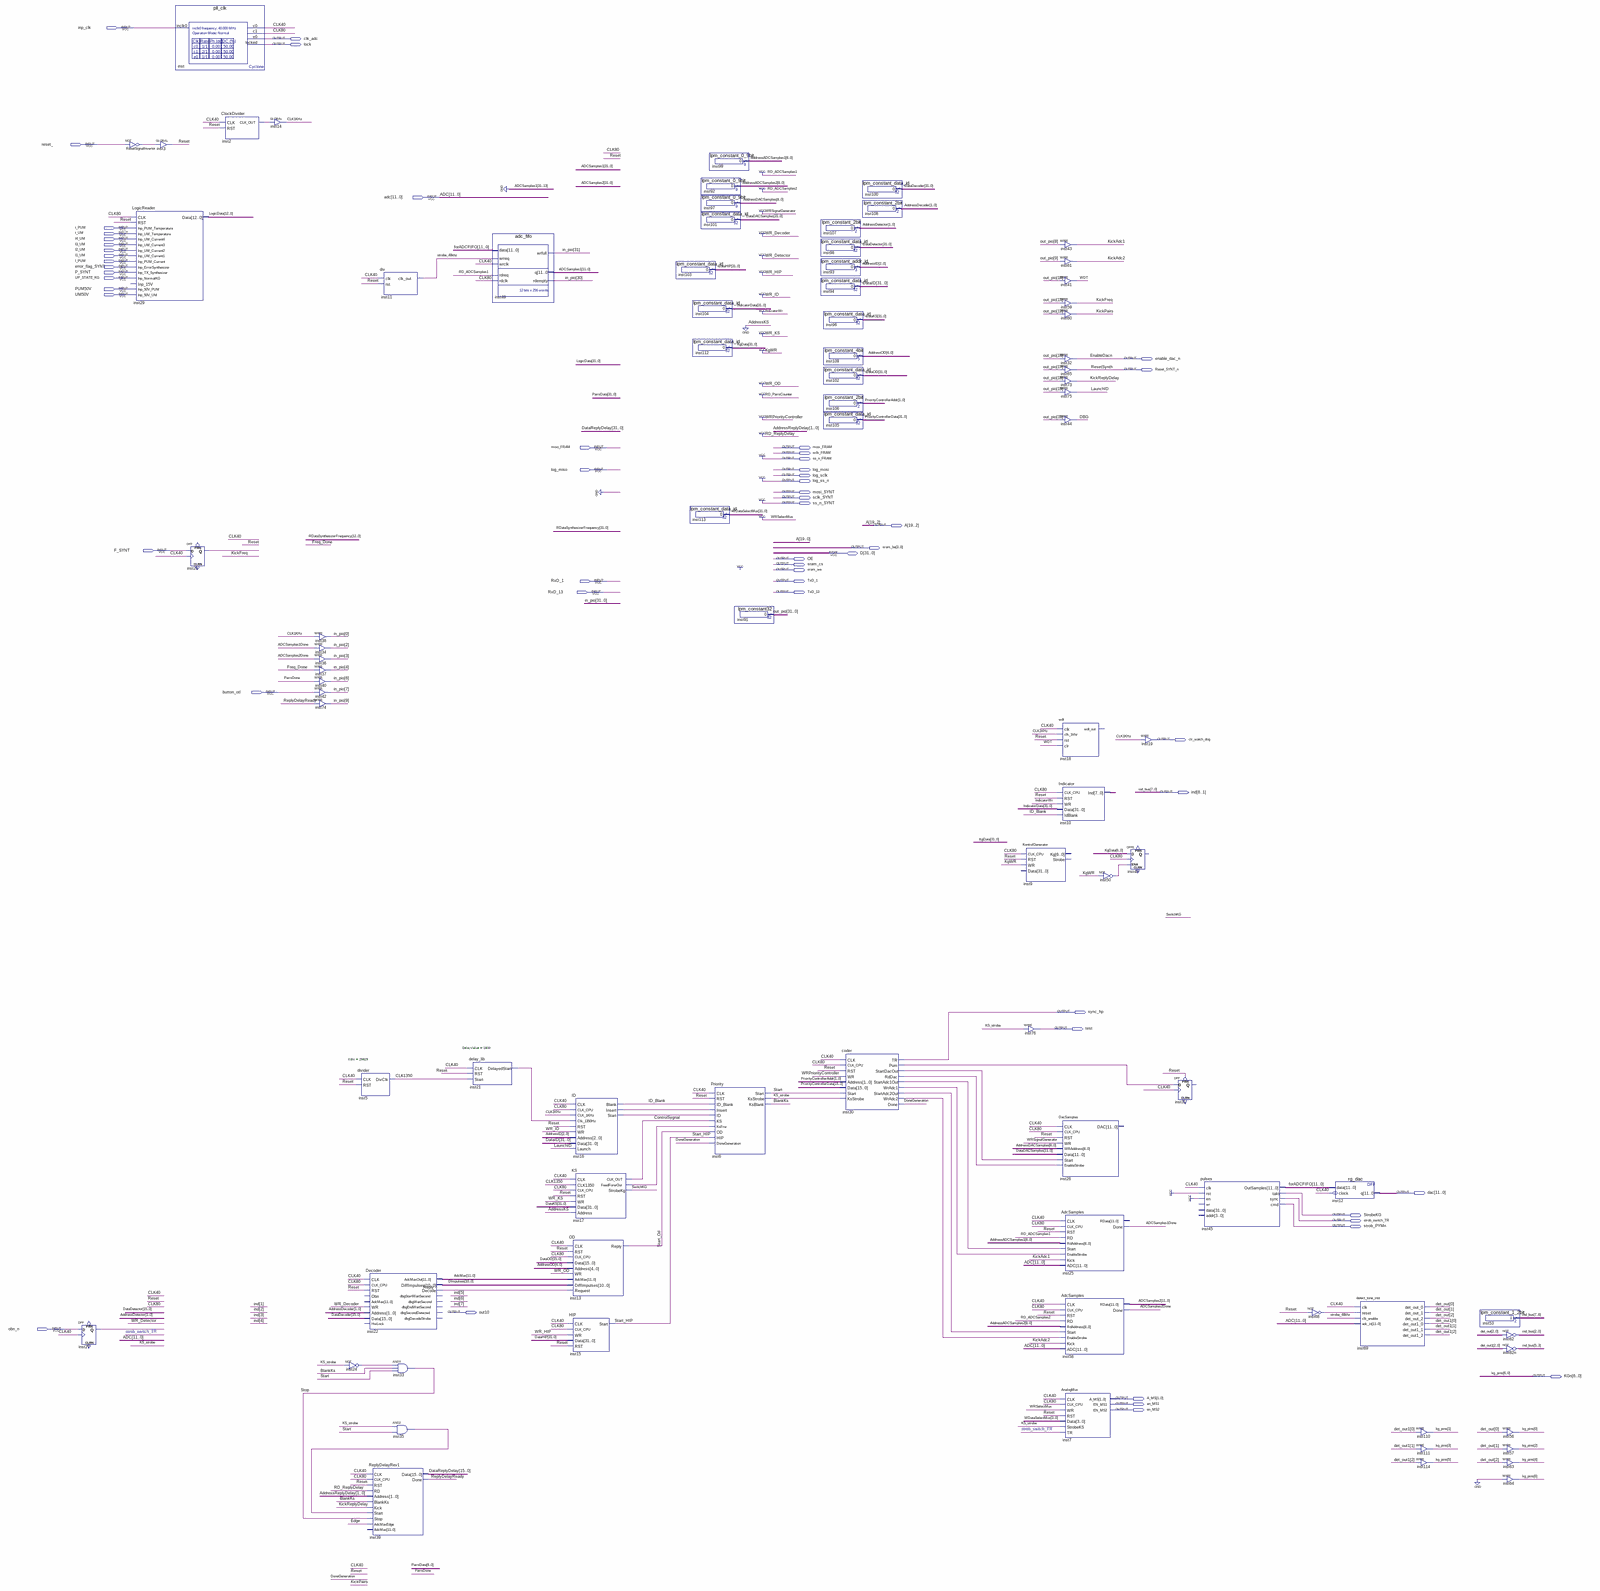
[diagram p0: schematic sheet, whole]
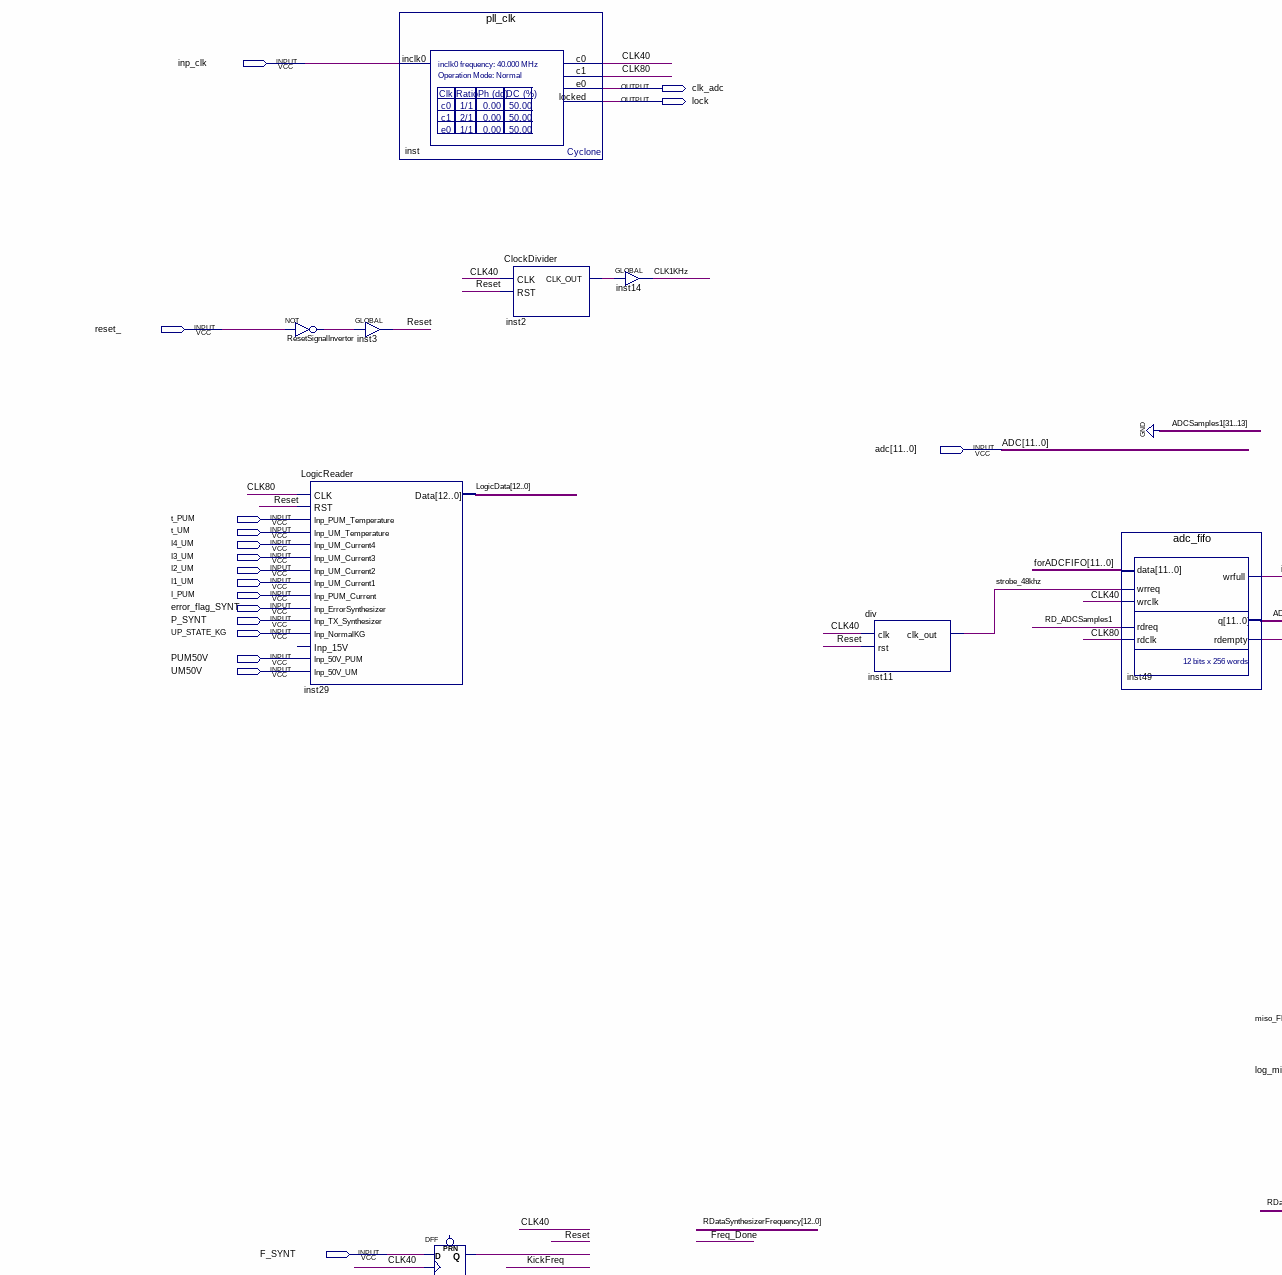
[diagram p1: schematic sheet, upper left part]
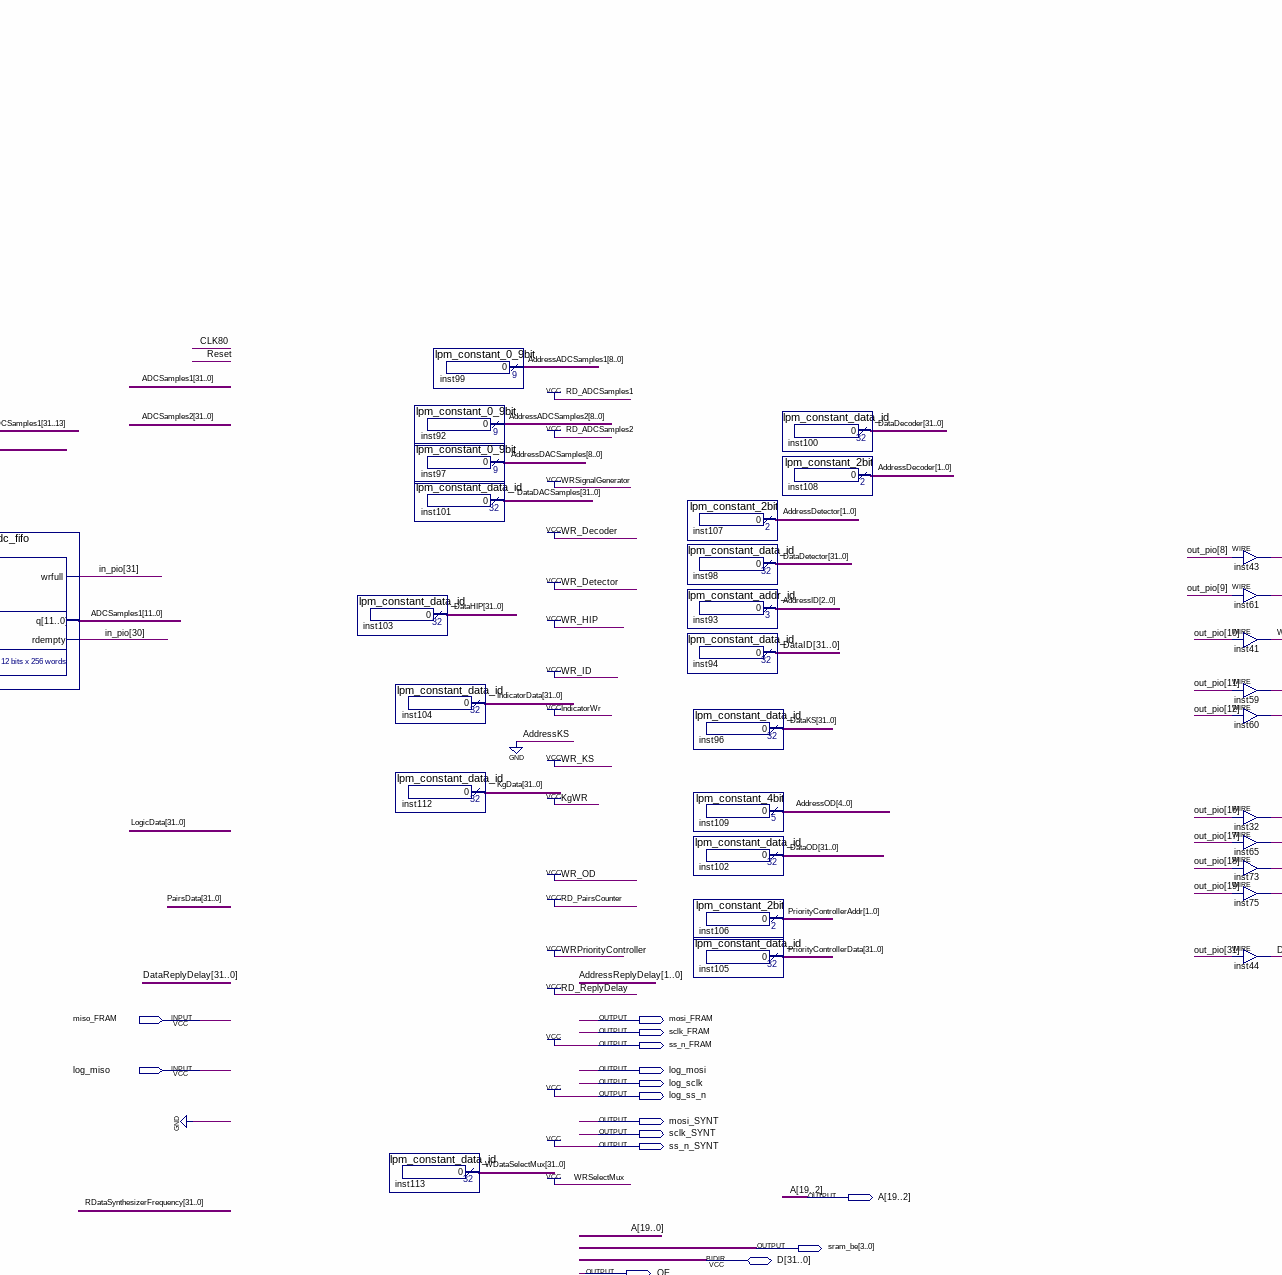
[diagram p2: schematic sheet, upper centre part]
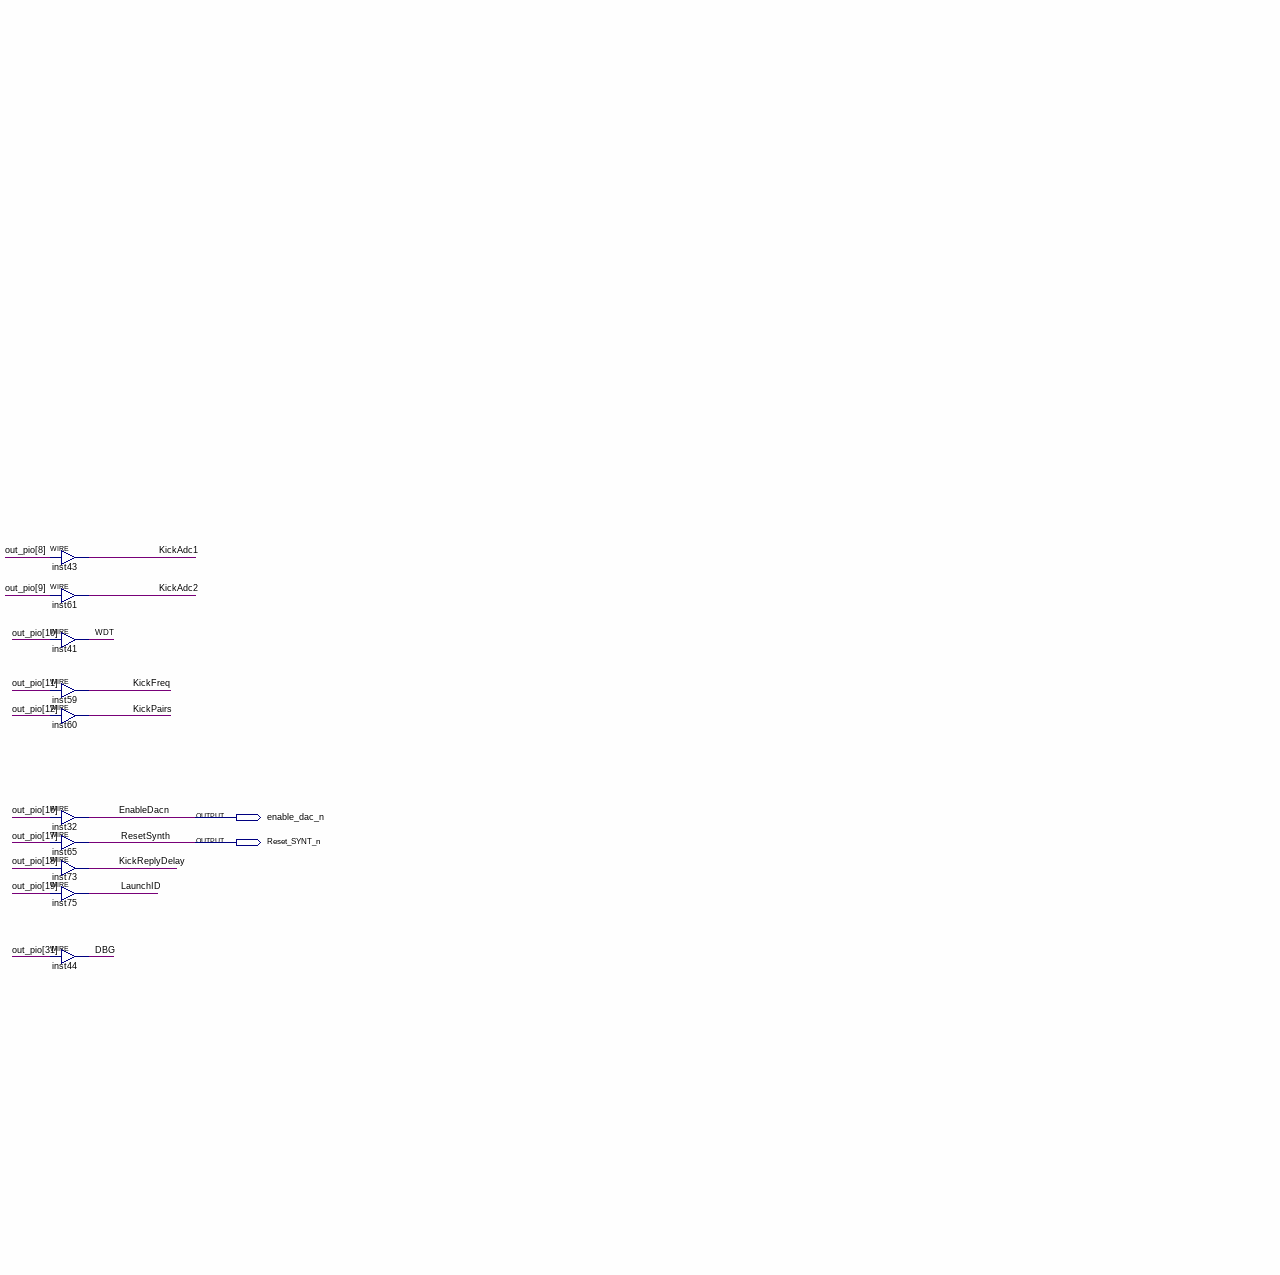
[diagram p3: schematic sheet, upper right part]
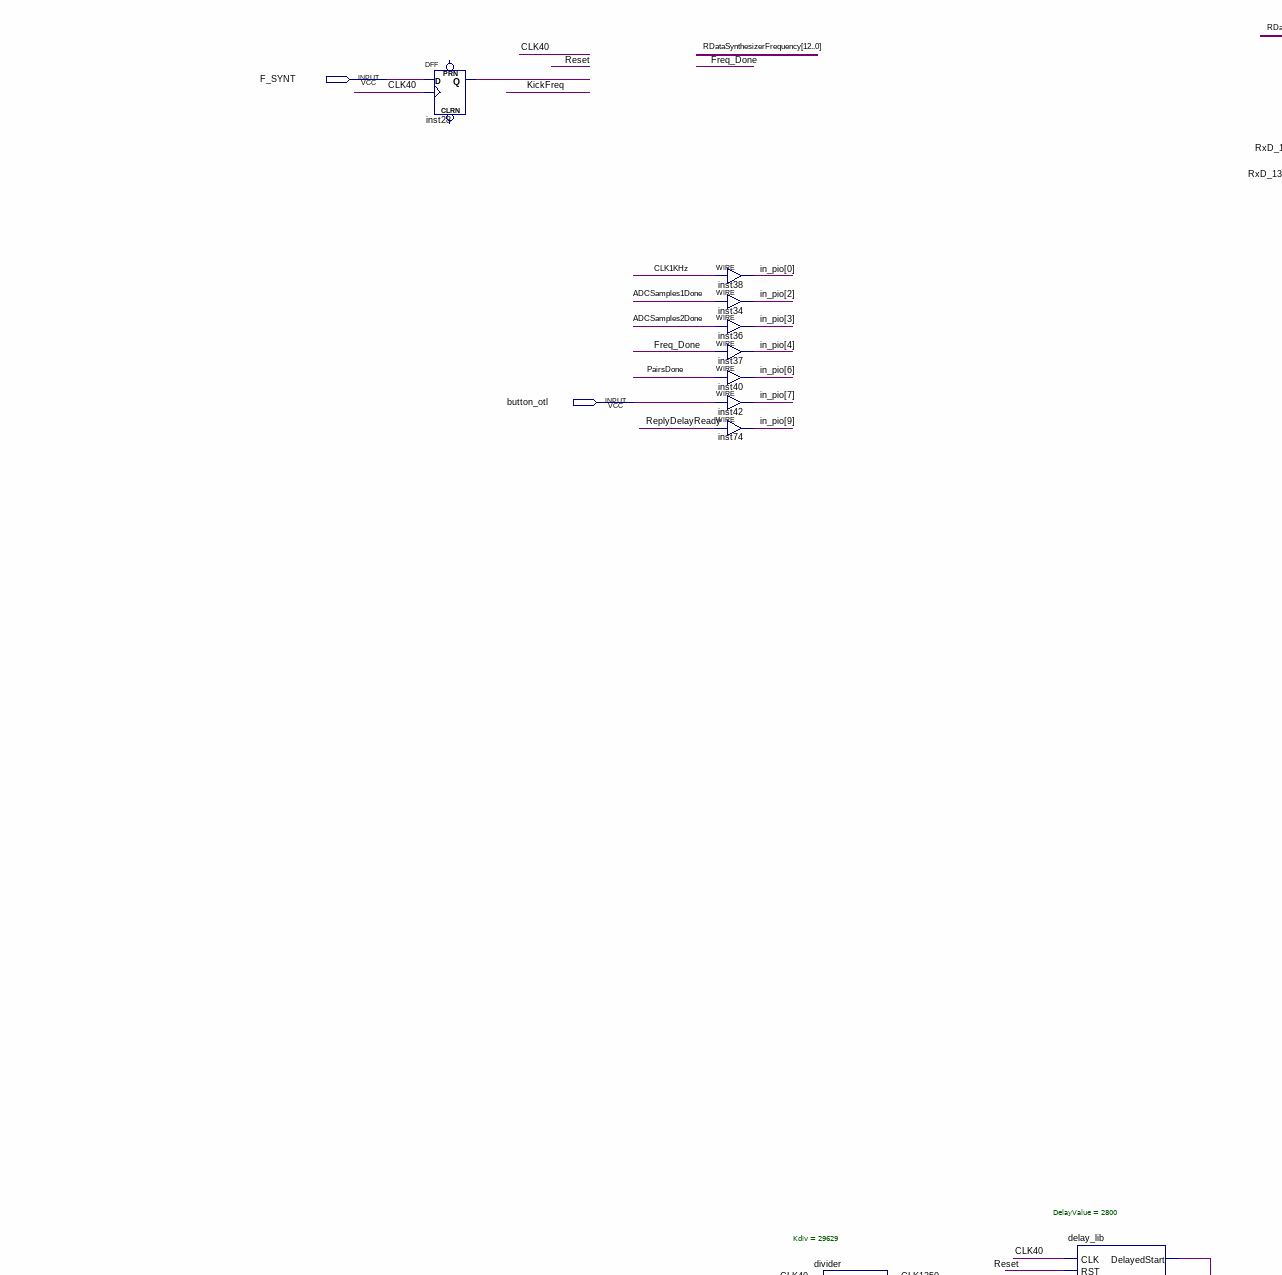
[diagram p4: schematic sheet, middle left part]
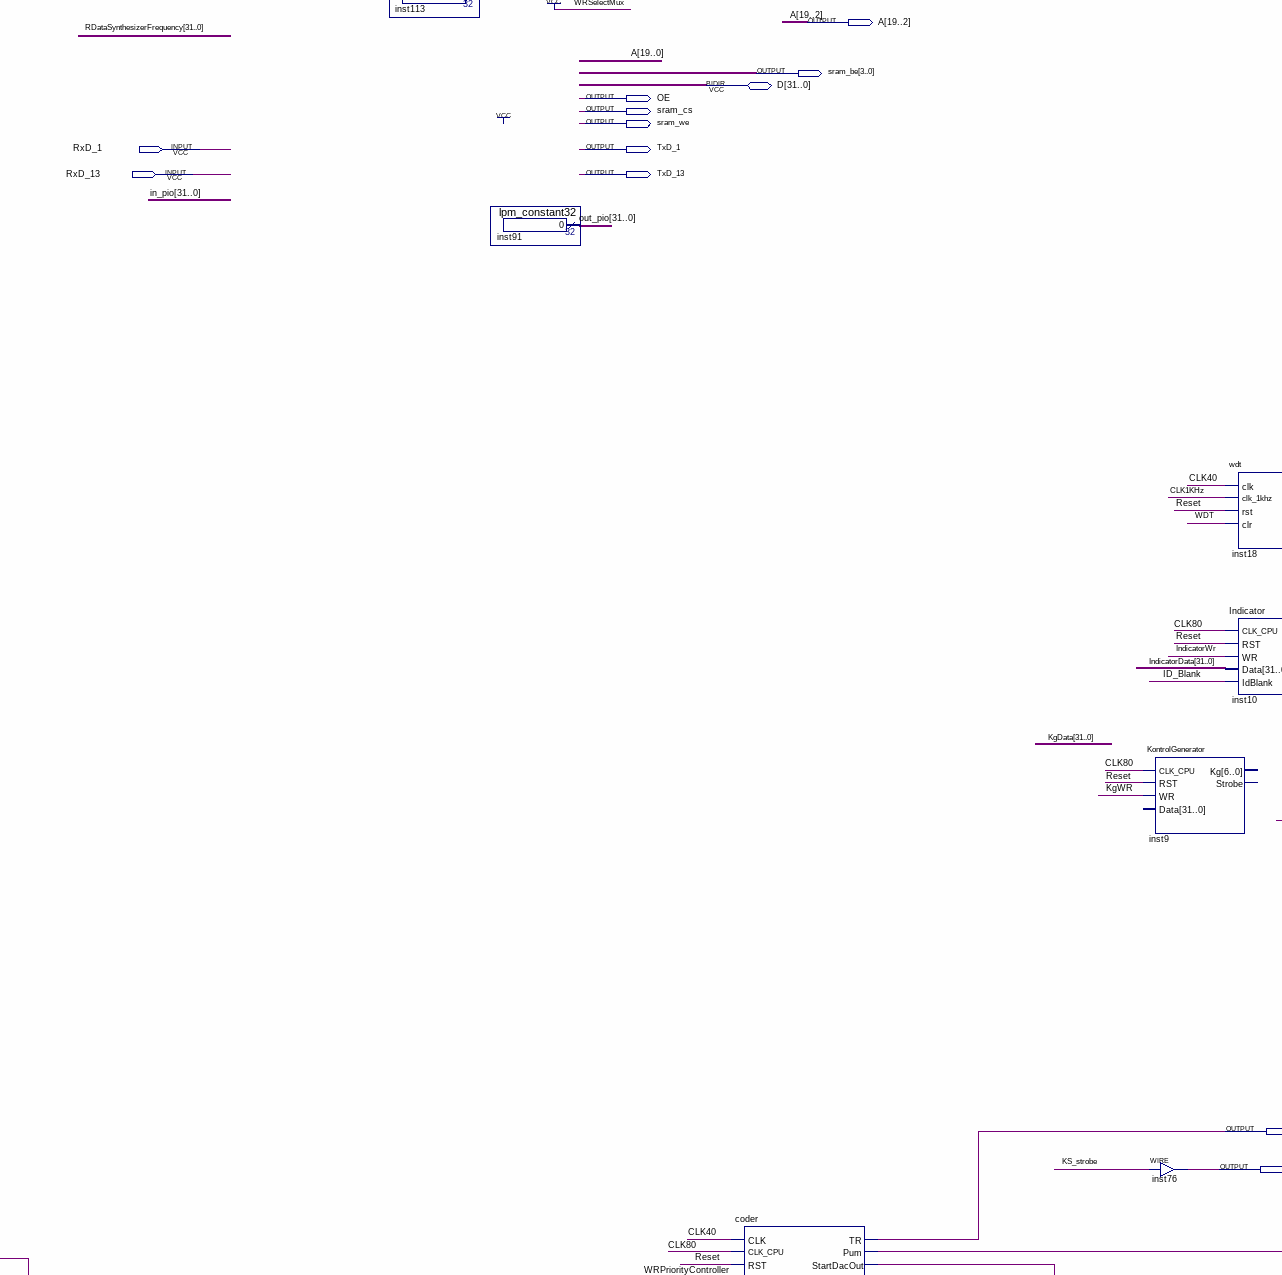
[diagram p5: schematic sheet, middle centre part]
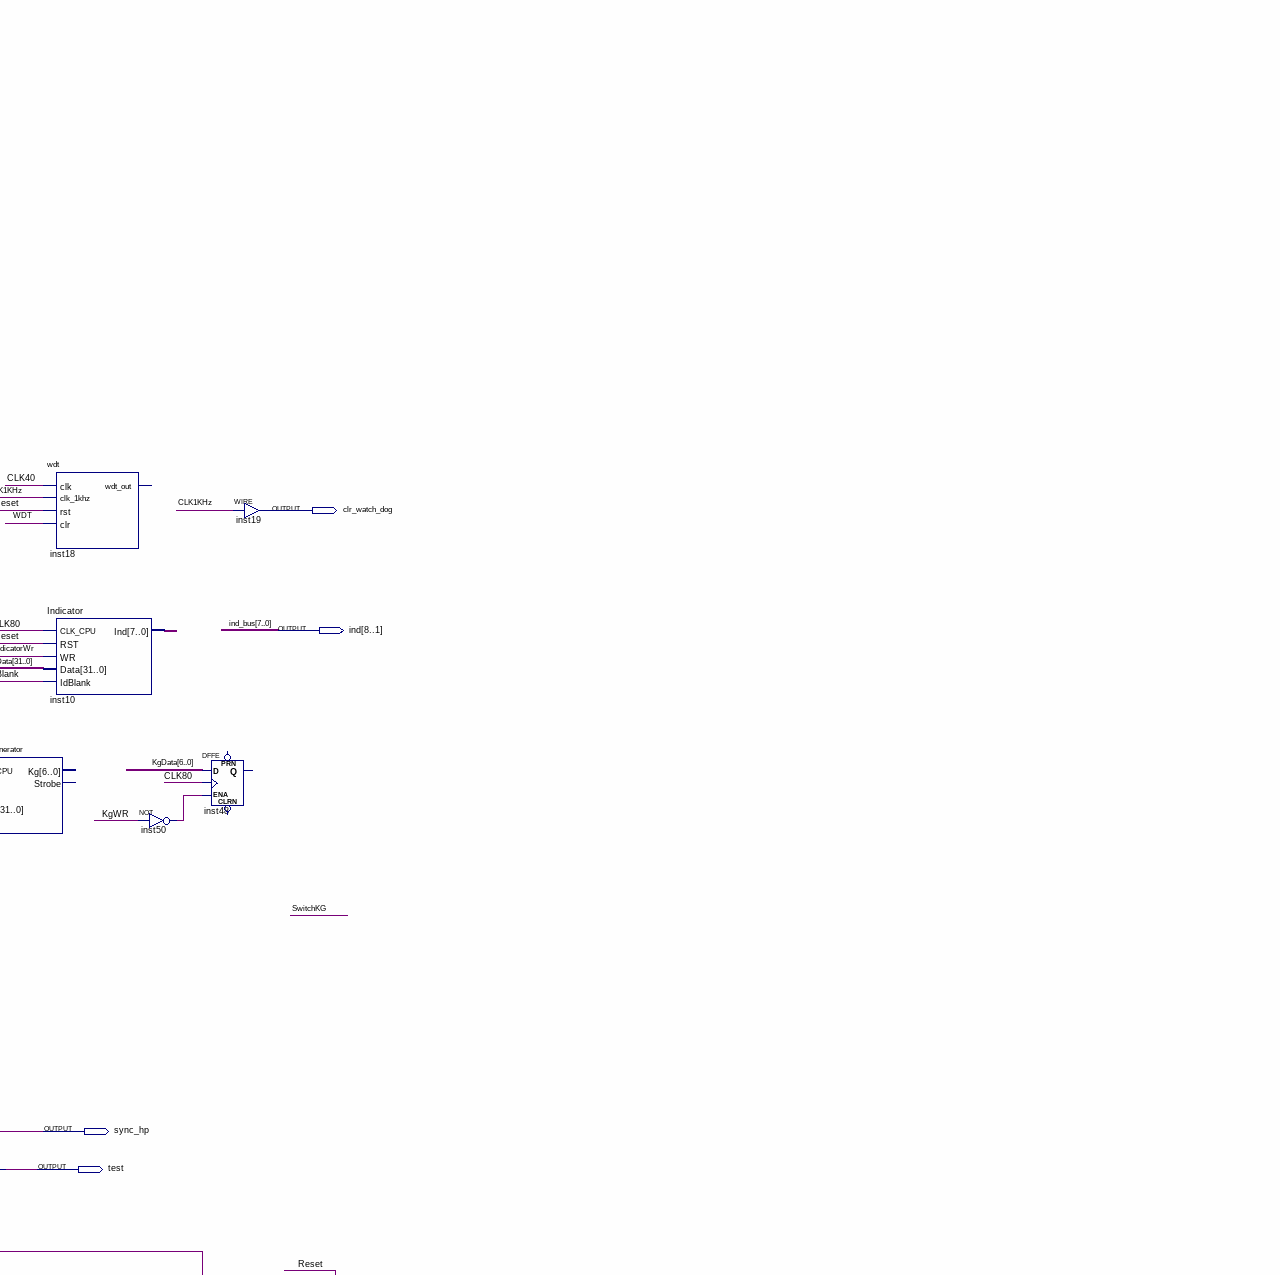
[diagram p6: schematic sheet, middle right part]
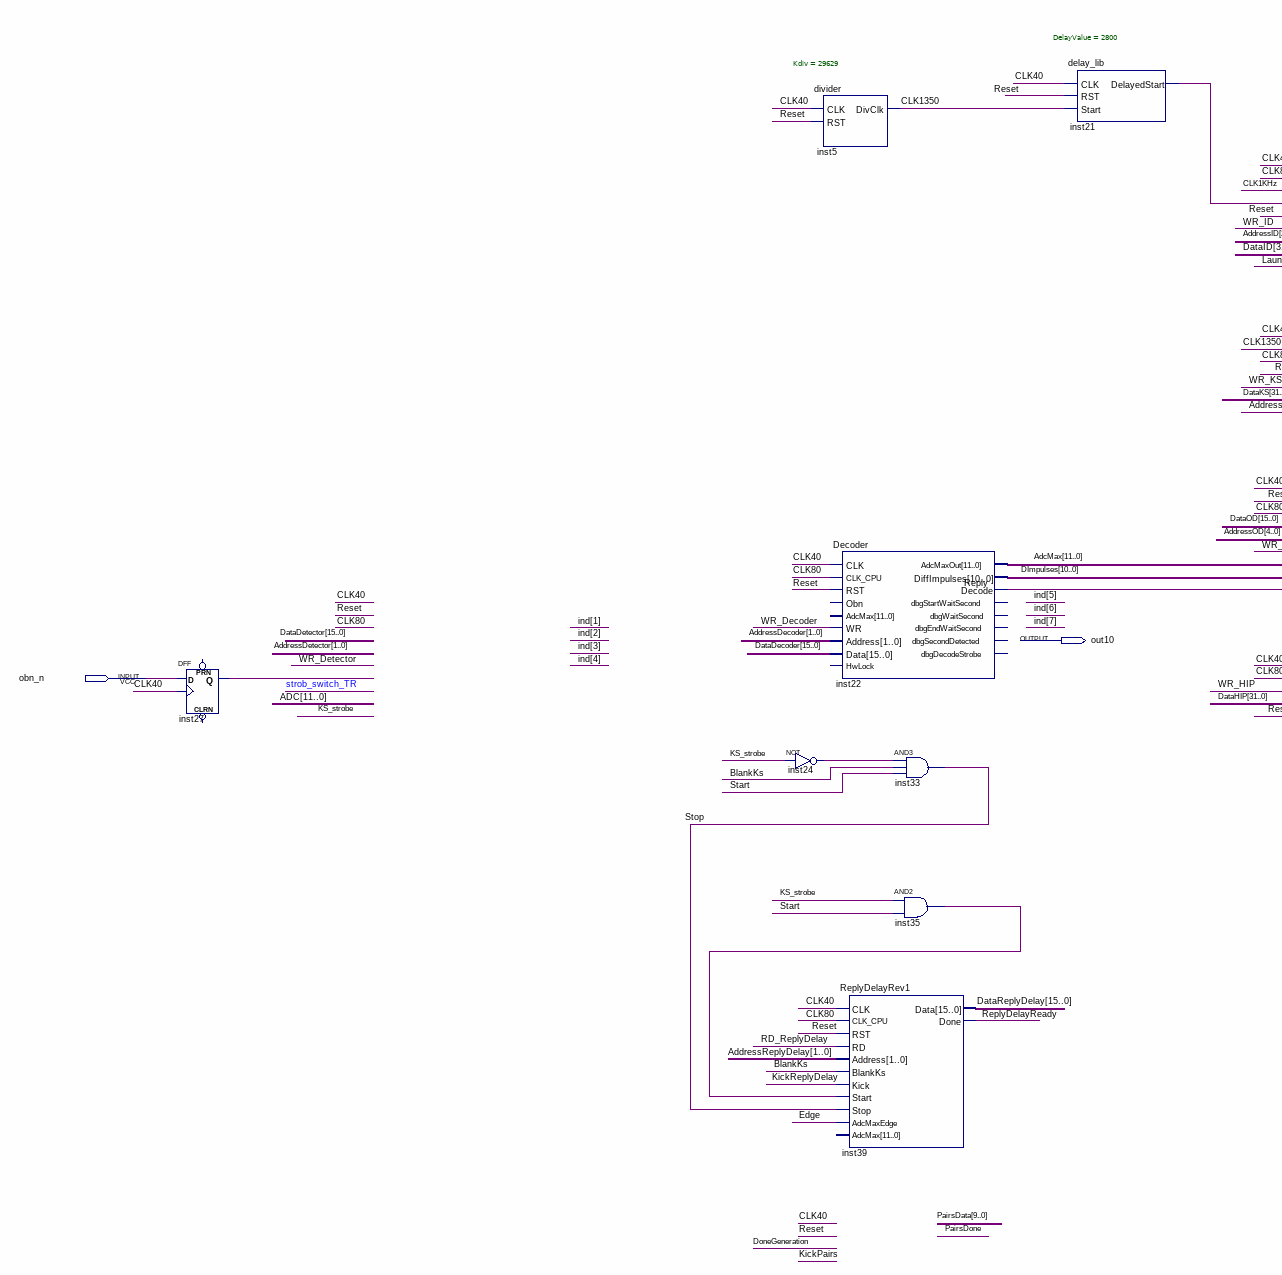
[diagram p7: schematic sheet, lower left part]
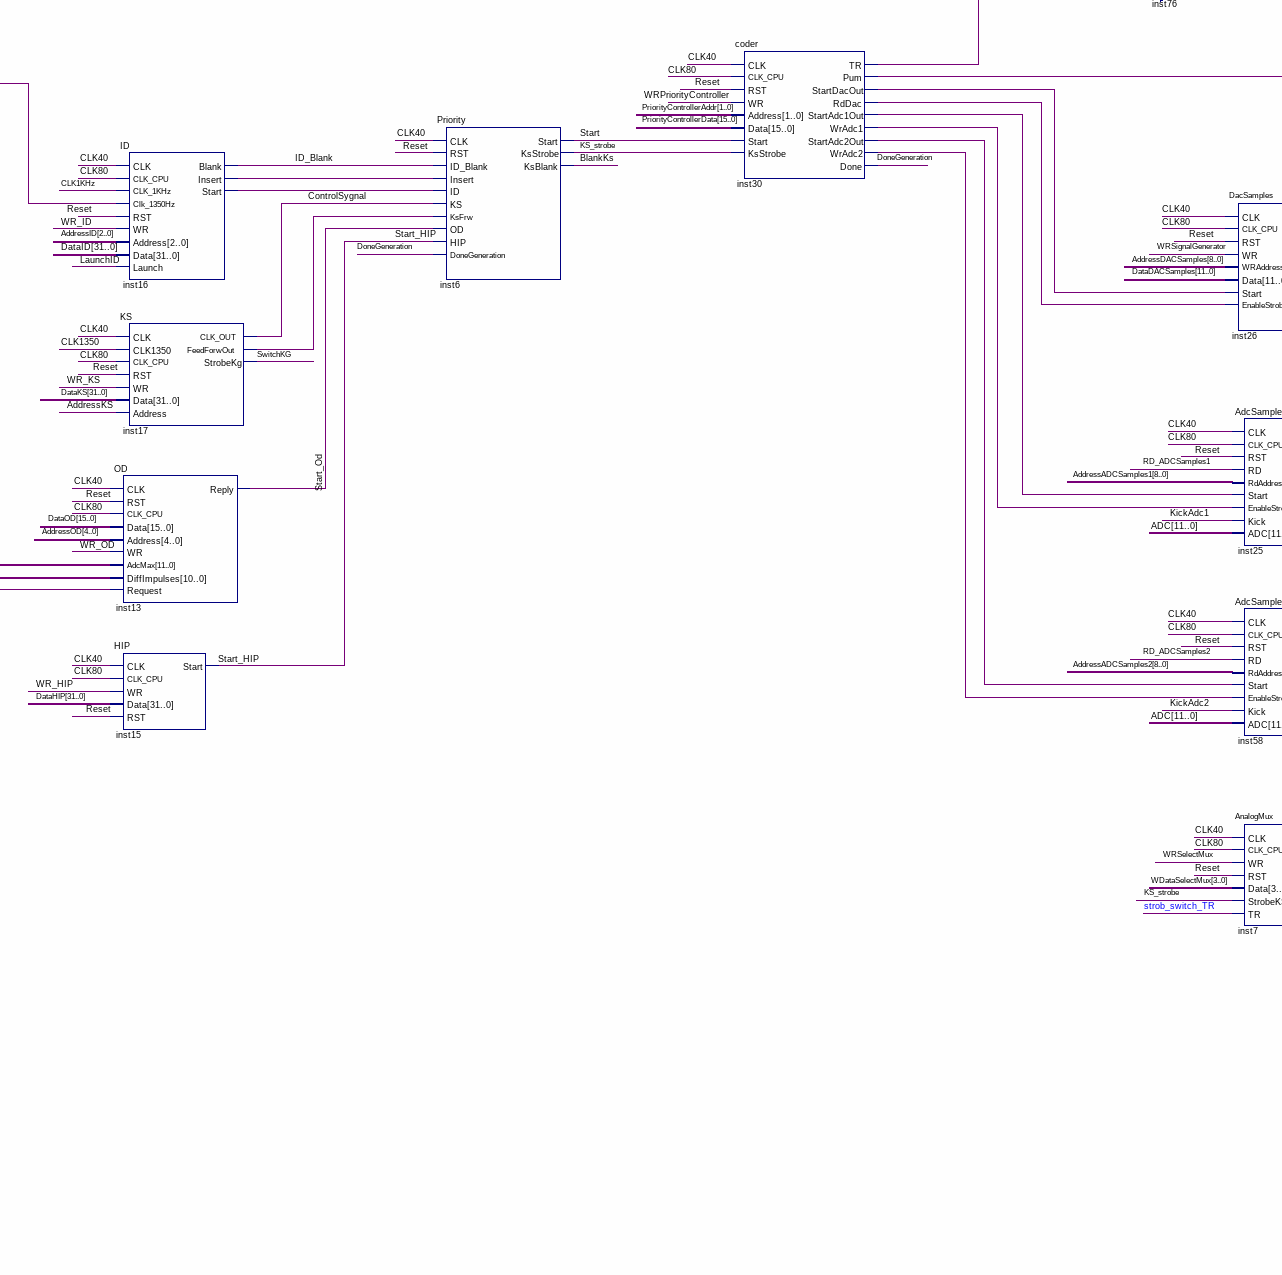
[diagram p8: schematic sheet, lower centre part]
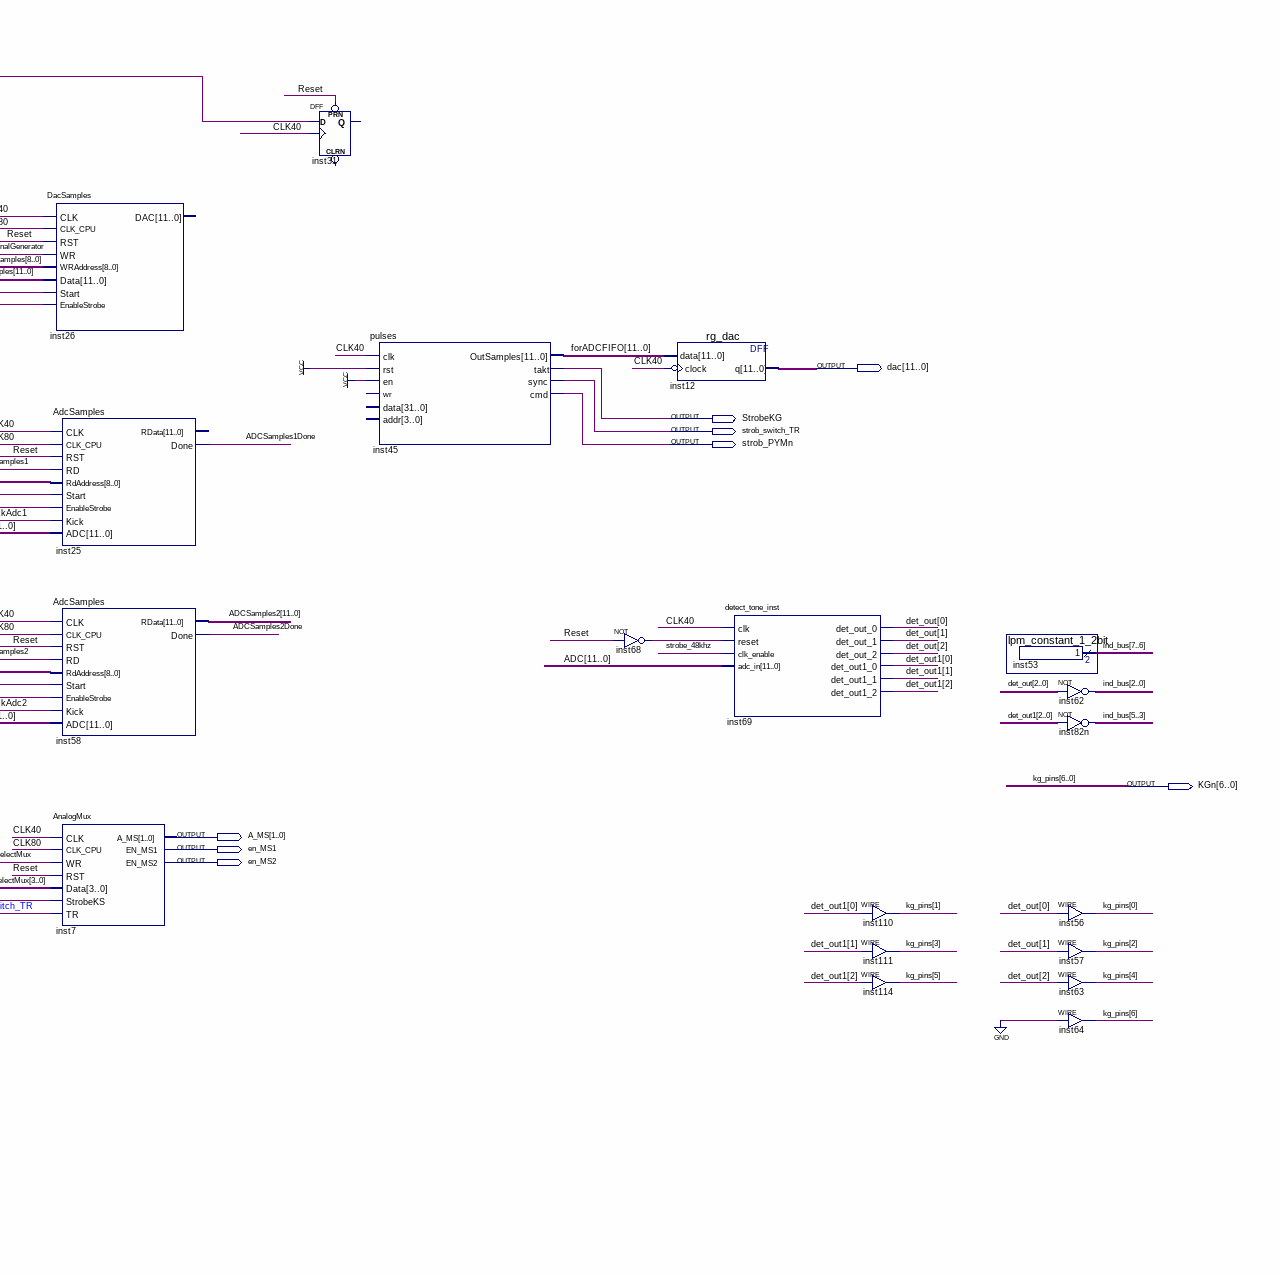
[diagram p9: schematic sheet, lower right part]
// Quartus schematic ControllerDME.bdf as structural Verilog: 86 symbols, 56 pins
module ControllerDME (
  input  inp_clk,
  input  reset_,
  input  [11:0] adc,
  input  t_PUM,
  input  t_UM,
  input  I4_UM,
  input  I3_UM,
  input  I2_UM,
  input  I1_UM,
  input  I_PUM,
  input  error_flag_SYNT,
  input  P_SYNT,
  input  UP_STATE_KG,
  input  PUM50V,
  input  UM50V,
  input  miso_FRAM,
  input  log_miso,
  input  F_SYNT,
  input  RxD_1,
  input  RxD_13,
  input  button_otl,
  input  obn_n,
  inout  [31:0] D,
  output clk_adc,
  output lock,
  output enable_dac_n,
  output Reset_SYNT_n,
  output mosi_FRAM,
  output sclk_FRAM,
  output ss_n_FRAM,
  output log_mosi,
  output log_sclk,
  output log_ss_n,
  output mosi_SYNT,
  output sclk_SYNT,
  output ss_n_SYNT,
  output [19:2] A,
  output [3:0] sram_be,
  output OE,
  output sram_cs,
  output sram_we,
  output TxD_1,
  output TxD_13,
  output clr_watch_dog,
  output [8:1] ind,
  output sync_hp,
  output test,
  output [11:0] dac,
  output StrobeKG,
  output strob_switch_TR,
  output strob_PYMn,
  output out10,
  output [6:0] KGn,
  output [1:0] A_MS,
  output en_MS1,
  output en_MS2
);

  wire ADCSamples1Done, ADCSamples2Done, BlankKs, CLK1KHz, CLK40, CLK80, CLK1350, ControlSygnal, DBG,
       DoneGeneration, Edge, Freq_Done, ID_Blank, inst2_clk_out, inst16_insert, inst16_start,
       inst17_feedforwout, inst21_delayedstart, inst24_out, inst27_q, inst28_q, inst30_pum, inst30_rddac,
       inst30_startadc1out, inst30_startadc2out, inst30_startdacout, inst30_wradc1, inst30_wradc2,
       inst35_out, inst50_out, inst68_out, KickAdc1, KickAdc2, KickFreq, KickPairs, KickReplyDelay,
       KS_strobe, LaunchID, PairsDone, Reply, ReplyDelayReady, Reset, ResetSignalInvertor_out, Start,
       Start_HIP, Start_Od, Stop, strobe_48khz, SwitchKG, WDT;
  wire [1:0] AddressDecoder, AddressDetector, AddressReplyDelay, PriorityControllerAddr;
  wire [2:0] AddressID, det_out, det_out1;
  wire [4:0] AddressOD;
  wire [7:0] inst10_ind;
  wire [8:0] AddressADCSamples1, AddressADCSamples2, AddressDACSamples;
  wire [10:0] DImpulses;
  wire [11:0] AdcMax, ADCSamples1, ADCSamples2, forADCFIFO;
  wire [12:0] LogicData;
  wire [15:0] DataReplyDelay;
  wire [31:0] DataDACSamples, DataDecoder, DataDetector, DataHIP, DataID, DataKS, DataOD, in_pio,
       IndicatorData, KgData, out_pio, PriorityControllerData, WDataSelectMux;

  DFF inst27 (.CLK(CLK40), .D(obn_n), .Q(inst27_q));  // open: CLRN, PRN
  not ResetSignalInvertor (ResetSignalInvertor_out, reset_);
  LogicReader inst29 (
    .CLK(CLK80), .RST(Reset), .Inp_PUM_Temperature(t_PUM), .Inp_UM_Temperature(t_UM),
    .Inp_UM_Current4(I4_UM), .Inp_UM_Current3(I3_UM), .Inp_UM_Current2(I2_UM), .Inp_UM_Current1(I1_UM),
    .Inp_PUM_Current(I_PUM), .Inp_ErrorSynthesizer(error_flag_SYNT), .Inp_TX_Synthesizer(P_SYNT),
    .Inp_NormalKG(UP_STATE_KG), .Inp_50V_PUM(PUM50V), .Inp_50V_UM(UM50V), .Data(LogicData));  // open: Inp_15V
  GLOBAL inst3 (.IN(ResetSignalInvertor_out), .OUT(Reset));
  pll_clk inst (.inclk0(inp_clk), .c0(CLK40), .c1(CLK80), .e0(clk_adc), .locked(lock));
  DFF inst28 (.CLK(CLK40), .D(F_SYNT), .Q(inst28_q));  // open: CLRN, PRN
  ClockDivider inst2 (.CLK(CLK40), .RST(Reset), .CLK_OUT(inst2_clk_out));
  GLOBAL inst14 (.IN(inst2_clk_out), .OUT(CLK1KHz));
  assign in_pio[0] = CLK1KHz;  // WIRE inst38
  assign in_pio[2] = ADCSamples1Done;  // WIRE inst34
  assign in_pio[3] = ADCSamples2Done;  // WIRE inst36
  assign in_pio[4] = Freq_Done;  // WIRE inst37
  assign in_pio[6] = PairsDone;  // WIRE inst40
  assign in_pio[7] = button_otl;  // WIRE inst42
  assign in_pio[9] = ReplyDelayReady;  // WIRE inst74
  divider #(.Kdiv(29629)) inst5 (.CLK(CLK40), .RST(Reset), .DivClk(CLK1350));
  not inst24 (inst24_out, KS_strobe);
  div inst11 (.clk(CLK40), .rst(Reset), .clk_out(strobe_48khz));
  Decoder inst22 (
    .CLK(CLK40), .CLK_CPU(CLK80), .RST(Reset), .WR(1'b1), .Address(AddressDecoder), .Data(DataDecoder[15:0]),
    .AdcMaxOut(AdcMax), .DiffImpulses(DImpulses), .Decode(Reply));  // open: Obn, AdcMax, HwLock, dbgStartWaitSecond, dbgWaitSecond, dbgEndWaitSecond, dbgSecondDetected, dbgDecodeStrobe
  ReplyDelayRev1 inst39 (
    .CLK(CLK40), .CLK_CPU(CLK80), .RST(Reset), .RD(1'b1), .Address(AddressReplyDelay), .BlankKs(BlankKs),
    .Kick(KickReplyDelay), .Start(inst35_out), .Stop(Stop), .AdcMaxEdge(Edge), .Data(DataReplyDelay),
    .Done(ReplyDelayReady));  // open: AdcMax
  and inst33 (Stop, inst24_out, BlankKs, Start);
  and inst35 (inst35_out, KS_strobe, Start);
  delay_lib #(.DelayValue(2800)) inst21 (.CLK(CLK40), .RST(Reset), .Start(CLK1350), .DelayedStart(inst21_delayedstart));
  adc_fifo inst49 (
    .data(forADCFIFO), .wrreq(strobe_48khz), .wrclk(CLK40), .rdreq(1'b1), .rdclk(CLK80), .wrfull(in_pio[31]),
    .q(ADCSamples1), .rdempty(in_pio[30]));
  ID inst16 (
    .CLK(CLK40), .CLK_CPU(CLK80), .CLK_1KHz(CLK1KHz), .Clk_1350Hz(inst21_delayedstart), .RST(Reset),
    .WR(1'b1), .Address(AddressID), .Data(DataID), .Launch(LaunchID), .Blank(ID_Blank),
    .Insert(inst16_insert), .Start(inst16_start));
  KS inst17 (
    .CLK(CLK40), .CLK1350(CLK1350), .CLK_CPU(CLK80), .RST(Reset), .WR(1'b1), .Data(DataKS), .Address(1'b0),
    .CLK_OUT(ControlSygnal), .FeedForwOut(inst17_feedforwout), .StrobeKg(SwitchKG));
  OD inst13 (
    .CLK(CLK40), .RST(Reset), .CLK_CPU(CLK80), .Data(DataOD[15:0]), .Address(AddressOD), .WR(1'b1),
    .AdcMax(AdcMax), .DiffImpulses(DImpulses), .Request(Reply), .Reply(Start_Od));
  HIP inst15 (.CLK(CLK40), .CLK_CPU(CLK80), .WR(1'b1), .Data(DataHIP), .RST(Reset), .Start(Start_HIP));
  lpm_constant_data_id inst103 (.result(DataHIP));
  lpm_constant_data_id inst113 (.result(WDataSelectMux));
  lpm_constant_0_9bit inst99 (.result(AddressADCSamples1));
  lpm_constant_0_9bit inst92 (.result(AddressADCSamples2));
  lpm_constant_0_9bit inst97 (.result(AddressDACSamples));
  lpm_constant_data_id inst101 (.result(DataDACSamples));
  lpm_constant_data_id inst104 (.result(IndicatorData));
  lpm_constant_data_id inst112 (.result(KgData));
  Priority inst6 (
    .CLK(CLK40), .RST(Reset), .ID_Blank(ID_Blank), .Insert(inst16_insert), .ID(inst16_start),
    .KS(ControlSygnal), .KsFrw(inst17_feedforwout), .OD(Start_Od), .HIP(Start_HIP),
    .DoneGeneration(DoneGeneration), .Start(Start), .KsStrobe(KS_strobe), .KsBlank(BlankKs));
  lpm_constant32 inst91 (.result(out_pio));
  lpm_constant_2bit inst107 (.result(AddressDetector));
  lpm_constant_data_id inst98 (.result(DataDetector));
  lpm_constant_addr_id inst93 (.result(AddressID));
  lpm_constant_data_id inst94 (.result(DataID));
  lpm_constant_data_id inst96 (.result(DataKS));
  lpm_constant_4bit inst109 (.result(AddressOD));
  lpm_constant_data_id inst102 (.result(DataOD));
  lpm_constant_2bit inst106 (.result(PriorityControllerAddr));
  lpm_constant_data_id inst105 (.result(PriorityControllerData));
  coder inst30 (
    .CLK(CLK40), .CLK_CPU(CLK80), .RST(Reset), .WR(1'b1), .Address(PriorityControllerAddr),
    .Data(PriorityControllerData[15:0]), .Start(Start), .KsStrobe(KS_strobe), .TR(sync_hp), .Pum(inst30_pum),
    .StartDacOut(inst30_startdacout), .RdDac(inst30_rddac), .StartAdc1Out(inst30_startadc1out),
    .WrAdc1(inst30_wradc1), .StartAdc2Out(inst30_startadc2out), .WrAdc2(inst30_wradc2), .Done(DoneGeneration));
  lpm_constant_data_id inst100 (.result(DataDecoder));
  lpm_constant_2bit inst108 (.result(AddressDecoder));
  KontrolGenerator inst9 (.CLK_CPU(CLK80), .RST(Reset), .WR(1'b1));  // open: Data, Kg, Strobe
  assign test = KS_strobe;  // WIRE inst76
  assign KickAdc1 = out_pio[8];  // WIRE inst43
  assign KickAdc2 = out_pio[9];  // WIRE inst61
  assign WDT = out_pio[10];  // WIRE inst41
  assign KickFreq = out_pio[11];  // WIRE inst59
  assign KickPairs = out_pio[12];  // WIRE inst60
  assign enable_dac_n = out_pio[16];  // WIRE inst32
  assign Reset_SYNT_n = out_pio[17];  // WIRE inst65
  assign KickReplyDelay = out_pio[18];  // WIRE inst73
  assign LaunchID = out_pio[19];  // WIRE inst75
  assign DBG = out_pio[31];  // WIRE inst44
  wdt inst18 (.clk(CLK40), .clk_1khz(CLK1KHz), .rst(Reset), .clr(WDT));  // open: wdt_out
  Indicator inst10 (
    .CLK_CPU(CLK80), .RST(Reset), .WR(1'b1), .Data(IndicatorData), .IdBlank(ID_Blank), .Ind(inst10_ind));
  DacSamples inst26 (
    .CLK(CLK40), .CLK_CPU(CLK80), .RST(Reset), .WR(1'b1), .WRAddress(AddressDACSamples),
    .Data(DataDACSamples[11:0]), .Start(inst30_startdacout), .EnableStrobe(inst30_rddac));  // open: DAC
  AdcSamples inst25 (
    .CLK(CLK40), .CLK_CPU(CLK80), .RST(Reset), .RD(1'b1), .RdAddress(AddressADCSamples1),
    .Start(inst30_startadc1out), .EnableStrobe(inst30_wradc1), .Kick(KickAdc1), .ADC(adc),
    .Done(ADCSamples1Done));  // open: RData
  AdcSamples inst58 (
    .CLK(CLK40), .CLK_CPU(CLK80), .RST(Reset), .RD(1'b1), .RdAddress(AddressADCSamples2),
    .Start(inst30_startadc2out), .EnableStrobe(inst30_wradc2), .Kick(KickAdc2), .ADC(adc),
    .RData(ADCSamples2), .Done(ADCSamples2Done));
  AnalogMux inst7 (
    .CLK(CLK40), .CLK_CPU(CLK80), .WR(1'b1), .RST(Reset), .Data(WDataSelectMux[3:0]), .StrobeKS(KS_strobe),
    .TR(strob_switch_TR), .A_MS(A_MS), .EN_MS1(en_MS1), .EN_MS2(en_MS2));
  not inst50 (inst50_out, 1'b1);
  DFFE inst48[6:0] (.D(KgData[6:0]), .CLK(CLK80), .ENA(inst50_out));  // open: PRN, CLRN, Q
  assign clr_watch_dog = CLK1KHz;  // WIRE inst19
  DFF inst31 (.CLK(CLK40), .D(inst30_pum), .PRN(Reset));  // open: CLRN, Q
  pulses inst45 (
    .clk(CLK40), .rst(1'b1), .en(1'b1), .OutSamples(forADCFIFO), .takt(StrobeKG), .sync(strob_switch_TR),
    .cmd(strob_PYMn));  // open: wr, data, addr
  not inst68 (inst68_out, Reset);
  rg_dac inst12 (.data(forADCFIFO), .clock(~CLK40), .q(dac));
  detect_tone_inst inst69 (
    .clk(CLK40), .reset(inst68_out), .clk_enable(strobe_48khz), .adc_in(adc), .det_out_0(det_out[0]),
    .det_out_1(det_out[1]), .det_out_2(det_out[2]), .det_out1_0(det_out1[0]), .det_out1_1(det_out1[1]),
    .det_out1_2(det_out1[2]));
  assign KGn[1] = det_out1[0];  // WIRE inst110
  assign KGn[3] = det_out1[1];  // WIRE inst111
  assign KGn[5] = det_out1[2];  // WIRE inst114
  lpm_constant_1_2bit inst53 (.result(ind[8:7]));
  assign ind[3:1] = ~det_out;  // NOT inst62, 3 bits wide
  assign ind[6:4] = ~det_out1;  // NOT inst82n, 3 bits wide
  assign KGn[0] = det_out[0];  // WIRE inst56
  assign KGn[2] = det_out[1];  // WIRE inst57
  assign KGn[4] = det_out[2];  // WIRE inst63
  assign KGn[6] = 1'b0;  // WIRE inst64

  assign log_ss_n = 1'b1;
  assign ss_n_FRAM = 1'b1;
  assign ss_n_SYNT = 1'b1;

  // Other names for the same wires on the sheet: EnableDacn = enable_dac_n; ind_bus[7:0] = ind; kg_pins[6:0] = KGn;
  //   ResetSynth = Reset_SYNT_n
endmodule
